# Altium schematic sheet 3_PowerDistribution.SchDoc: FPGA Power Distribution
size A3; Date: 12/24/2025; Author: Praveen Perera; DrawnBy: Praveen Perera; Engineer: Praveen Perera; Revision: 1; SheetNumber: 3; SheetTotal: 9
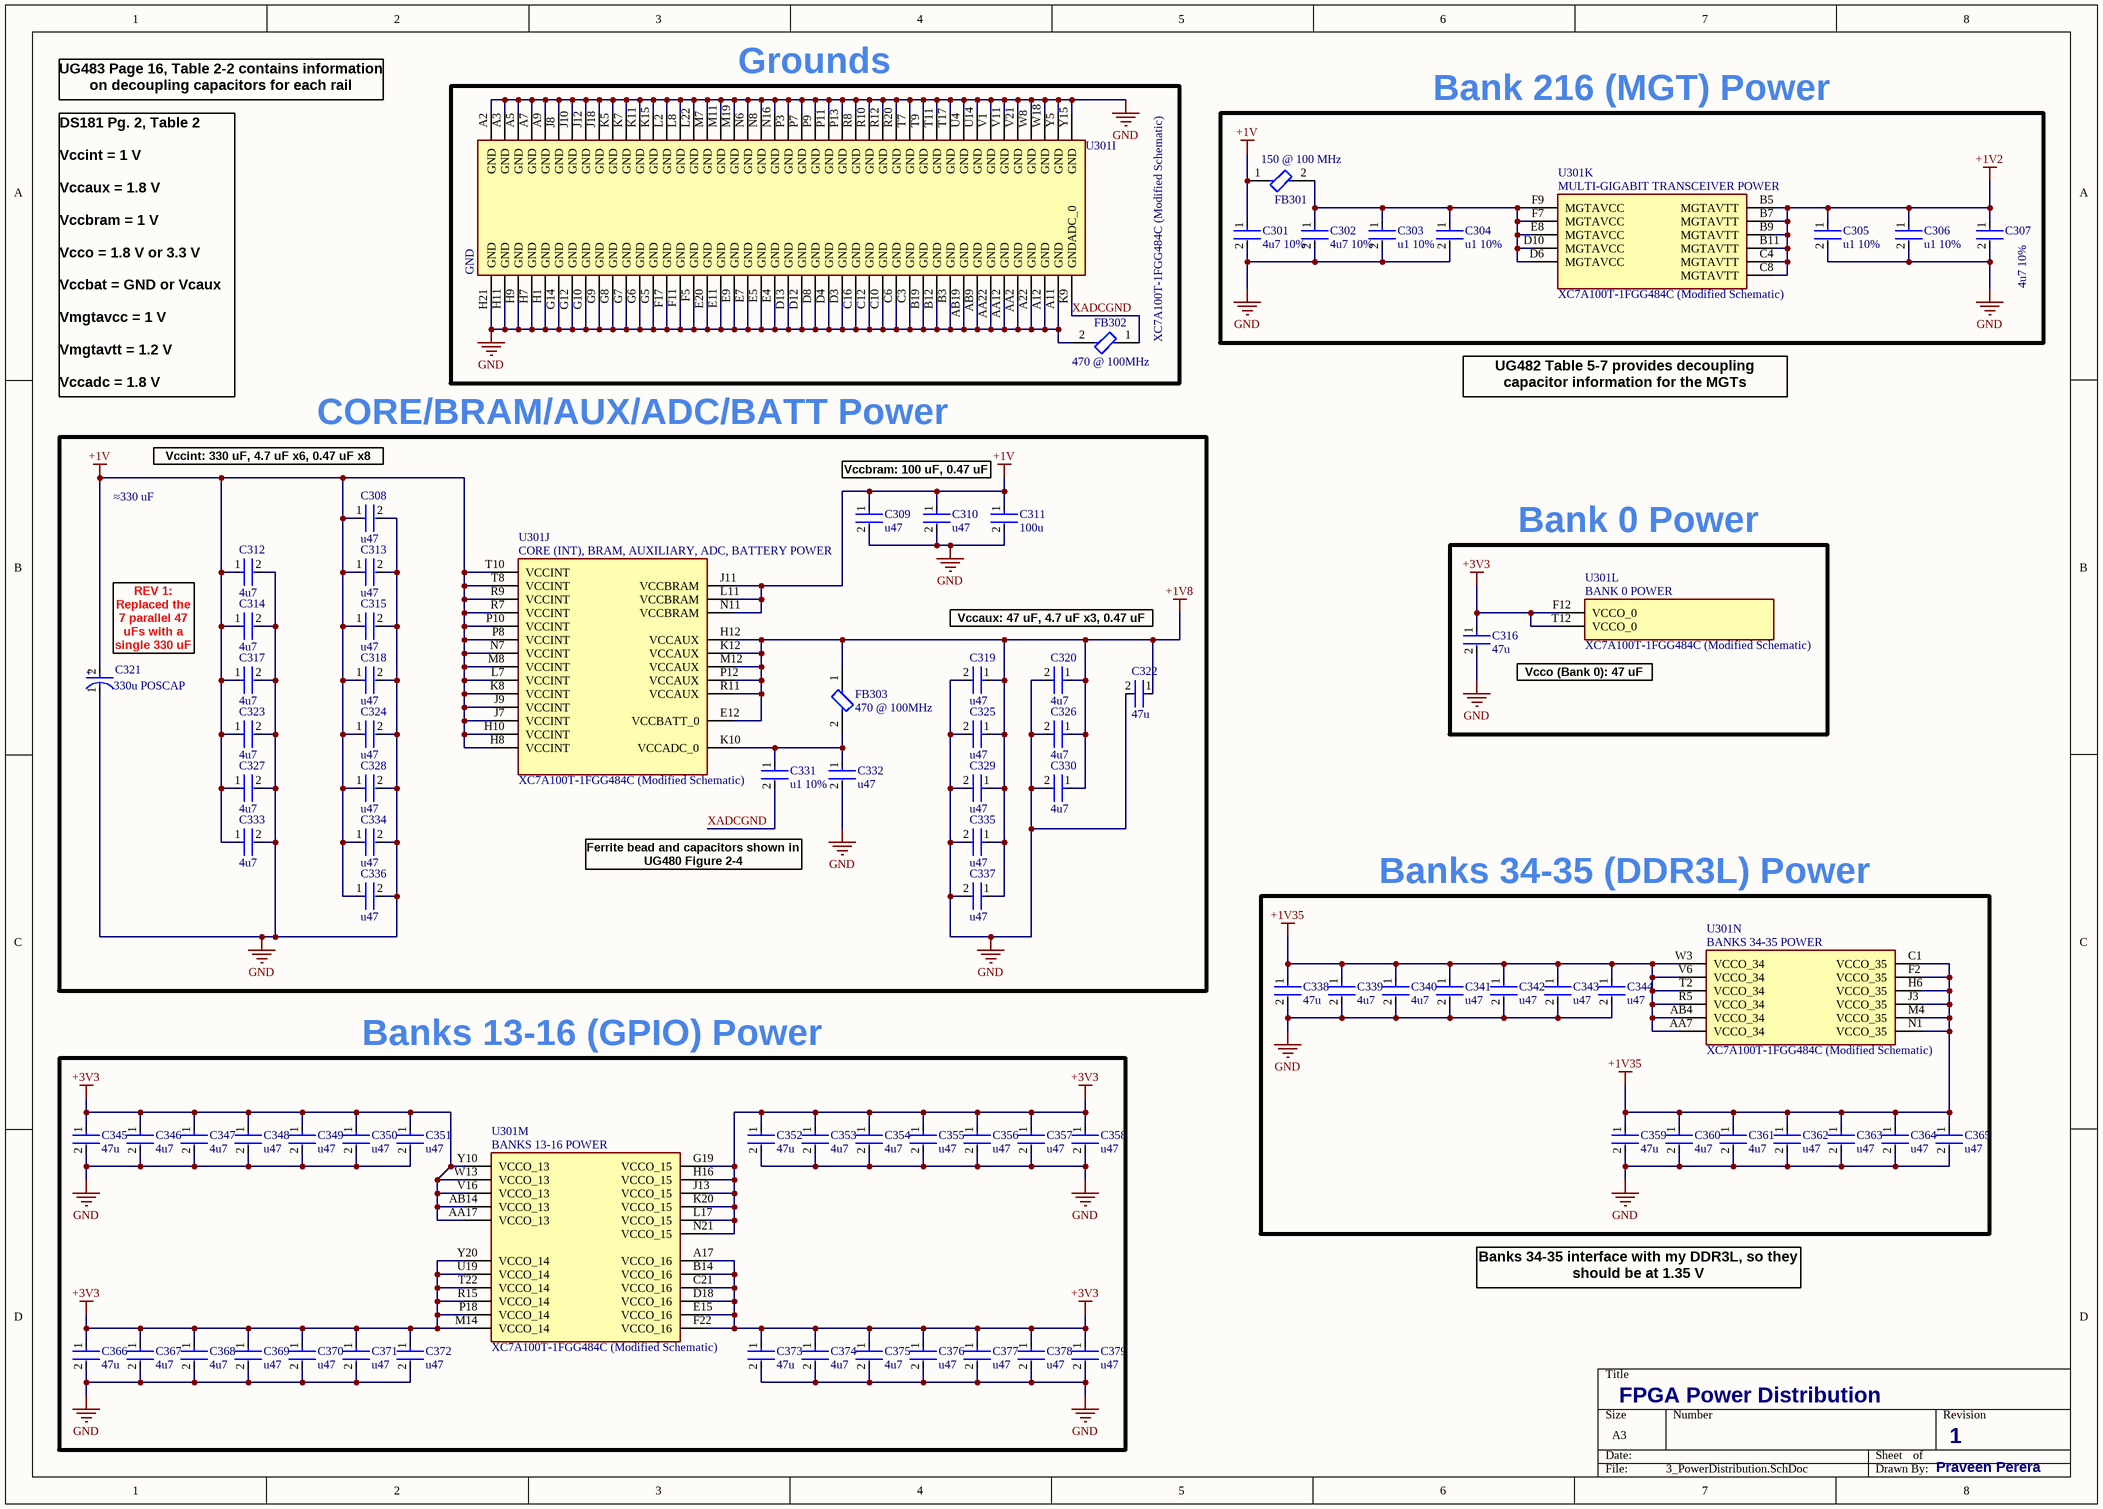
[diagram p0: 3_PowerDistribution.SchDoc]

## Parts
C301  4u7 10%  [FP-C1005-050-0_20-0_10-MFG]
C302  4u7 10%  [FP-C1005-050-0_20-0_10-MFG]
C303  u1 10%  [FP-CL891-IPC_C]
C304  u1 10%  [FP-CL891-IPC_C]
C305  u1 10%  [FP-CL891-IPC_C]
C306  u1 10%  [FP-CL891-IPC_C]
C307  4u7 10%  [FP-C1005-050-0_20-0_10-MFG]
C308  u47  [FP-C0603-030-0_03-IPC_A]
C309  u47  [FP-C0603-030-0_03-IPC_A]
C310  u47  [FP-C0603-030-0_03-IPC_A]
C311  100u  [FP-GRM21B-0_2-e0_2_0_7-IPC_A]
C312  4u7  [FP-CL829-IPC_C]
C313  u47  [FP-C0603-030-0_03-IPC_A]
C314  4u7  [FP-CL829-IPC_C]
C315  u47  [FP-C0603-030-0_03-IPC_A]
C316  47u  [FP-GRM188-0_2-IPC_B]
C317  4u7  [FP-CL829-IPC_C]
C318  u47  [FP-C0603-030-0_03-IPC_A]
C319  u47  [FP-C0603-030-0_03-IPC_A]
C320  4u7  [FP-CL829-IPC_C]
C321  330u POSCAP  [FP-POSCAP-D4-MFG]
C322  47u  [FP-GRM188-0_2-IPC_B]
C323  4u7  [FP-CL829-IPC_C]
C324  u47  [FP-C0603-030-0_03-IPC_A]
C325  u47  [FP-C0603-030-0_03-IPC_A]
C326  4u7  [FP-CL829-IPC_C]
C327  4u7  [FP-CL829-IPC_C]
C328  u47  [FP-C0603-030-0_03-IPC_A]
C329  u47  [FP-C0603-030-0_03-IPC_A]
C330  4u7  [FP-CL829-IPC_C]
C331  u1 10%  [FP-CL891-IPC_C]
C332  u47  [FP-C0603-030-0_03-IPC_A]
C333  4u7  [FP-CL829-IPC_C]
C334  u47  [FP-C0603-030-0_03-IPC_A]
C335  u47  [FP-C0603-030-0_03-IPC_A]
C336  u47  [FP-C0603-030-0_03-IPC_A]
C337  u47  [FP-C0603-030-0_03-IPC_A]
C338  47u  [FP-GRM188-0_2-IPC_B]
C339  4u7  [FP-CL829-IPC_C]
C340  4u7  [FP-CL829-IPC_C]
C341  u47  [FP-C0603-030-0_03-IPC_A]
C342  u47  [FP-C0603-030-0_03-IPC_A]
C343  u47  [FP-C0603-030-0_03-IPC_A]
C344  u47  [FP-C0603-030-0_03-IPC_A]
C345  47u  [FP-GRM188-0_2-IPC_B]
C346  4u7  [FP-CL829-IPC_C]
C347  4u7  [FP-CL829-IPC_C]
C348  u47  [FP-C0603-030-0_03-IPC_A]
C349  u47  [FP-C0603-030-0_03-IPC_A]
C350  u47  [FP-C0603-030-0_03-IPC_A]
C351  u47  [FP-C0603-030-0_03-IPC_A]
C352  47u  [FP-GRM188-0_2-IPC_B]
C353  4u7  [FP-CL829-IPC_C]
C354  4u7  [FP-CL829-IPC_C]
C355  u47  [FP-C0603-030-0_03-IPC_A]
C356  u47  [FP-C0603-030-0_03-IPC_A]
C357  u47  [FP-C0603-030-0_03-IPC_A]
C358  u47  [FP-C0603-030-0_03-IPC_A]
C359  47u  [FP-GRM188-0_2-IPC_B]
C360  4u7  [FP-CL829-IPC_C]
C361  4u7  [FP-CL829-IPC_C]
C362  u47  [FP-C0603-030-0_03-IPC_A]
C363  u47  [FP-C0603-030-0_03-IPC_A]
C364  u47  [FP-C0603-030-0_03-IPC_A]
C365  u47  [FP-C0603-030-0_03-IPC_A]
C366  47u  [FP-GRM188-0_2-IPC_B]
C367  4u7  [FP-CL829-IPC_C]
C368  4u7  [FP-CL829-IPC_C]
C369  u47  [FP-C0603-030-0_03-IPC_A]
C370  u47  [FP-C0603-030-0_03-IPC_A]
C371  u47  [FP-C0603-030-0_03-IPC_A]
C372  u47  [FP-C0603-030-0_03-IPC_A]
C373  47u  [FP-GRM188-0_2-IPC_B]
C374  4u7  [FP-CL829-IPC_C]
C375  4u7  [FP-CL829-IPC_C]
C376  u47  [FP-C0603-030-0_03-IPC_A]
C377  u47  [FP-C0603-030-0_03-IPC_A]
C378  u47  [FP-C0603-030-0_03-IPC_A]
C379  u47  [FP-C0603-030-0_03-IPC_A]
FB301  150 @ 100 MHz  [FP-MPZ1005-IPC_B]
FB302  470 @ 100MHz  [FP-BLM41-0_2-a1_2-IPC_B]
FB303  470 @ 100MHz  [FP-BLM41-0_2-a1_2-IPC_B]
U301  XC7A100T-1FGG484C (Modified Schematic)  [BGA484C100P22X22_2300X2300X260N]  (parts I,J,K,L,M,N of 14)

## Blocks framed on the sheet
≈330 uF: C308-C315 C317-C337 FB303 U301

## Nets
+1V: C301.1 C308.1 C309.1 C310.1 C311.1 C312.1 C313.1 C314.1 C315.1 C317.1 C318.1 C321.2(A) C323.1 C324.1 C327.1 C328.1 C333.1 C334.1 C336.1 FB301.1 U301.H8(VCCINT) U301.H10(VCCINT) U301.J7(VCCINT) U301.J9(VCCINT) U301.J11(VCCBRAM) U301.K8(VCCINT) U301.L7(VCCINT) U301.L11(VCCBRAM) U301.M8(VCCINT) U301.N7(VCCINT) U301.N11(VCCBRAM) U301.P8(VCCINT) U301.P10(VCCINT) U301.R7(VCCINT) U301.R9(VCCINT) U301.T8(VCCINT) U301.T10(VCCINT)
+1V2: C305.1 C306.1 C307.1 U301.B5(MGTAVTT) U301.B7(MGTAVTT) U301.B9(MGTAVTT) U301.B11(MGTAVTT) U301.C4(MGTAVTT) U301.C8(MGTAVTT)
+1V8: C319.1 C320.1 C322.1 C325.1 C326.1 C329.1 C330.1 C335.1 C337.1 FB303.1 U301.E12(VCCBATT_0) U301.H12(VCCAUX) U301.K12(VCCAUX) U301.M12(VCCAUX) U301.P12(VCCAUX) U301.R11(VCCAUX)
+1V35: C338.1 C339.1 C340.1 C341.1 C342.1 C343.1 C344.1 C359.1 C360.1 C361.1 C362.1 C363.1 C364.1 C365.1 U301.AA7(VCCO_34) U301.AB4(VCCO_34) U301.C1(VCCO_35) U301.F2(VCCO_35) U301.H6(VCCO_35) U301.J3(VCCO_35) U301.M4(VCCO_35) U301.N1(VCCO_35) U301.R5(VCCO_34) U301.T2(VCCO_34) U301.V6(VCCO_34) U301.W3(VCCO_34)
+3V3: C316.1 C345.1 C346.1 C347.1 C348.1 C349.1 C350.1 C351.1 C352.1 C353.1 C354.1 C355.1 C356.1 C357.1 C358.1 C366.1 C367.1 C368.1 C369.1 C370.1 C371.1 C372.1 C373.1 C374.1 C375.1 C376.1 C377.1 C378.1 C379.1 U301.A17(VCCO_16) U301.AA17(VCCO_13) U301.AB14(VCCO_13) U301.B14(VCCO_16) U301.C21(VCCO_16) U301.D18(VCCO_16) U301.E15(VCCO_16) U301.F12(VCCO_0) U301.F22(VCCO_16) U301.G19(VCCO_15) U301.H16(VCCO_15) U301.J13(VCCO_15) U301.K20(VCCO_15) U301.L17(VCCO_15) U301.M14(VCCO_14) U301.N21(VCCO_15) U301.P18(VCCO_14) U301.R15(VCCO_14) U301.T12(VCCO_0) U301.T22(VCCO_14) U301.U19(VCCO_14) U301.V16(VCCO_13) U301.W13(VCCO_13) U301.Y10(VCCO_13) U301.Y20(VCCO_14)
GND: C301.2 C302.2 C303.2 C304.2 C305.2 C306.2 C307.2 C308.2 C309.2 C310.2 C311.2 C312.2 C313.2 C314.2 C315.2 C316.2 C317.2 C318.2 C319.2 C320.2 C321.1(C) C322.2 C323.2 C324.2 C325.2 C326.2 C327.2 C328.2 C329.2 C330.2 C332.2 C333.2 C334.2 C335.2 C336.2 C337.2 C338.2 C339.2 C340.2 C341.2 C342.2 C343.2 C344.2 C345.2 C346.2 C347.2 C348.2 C349.2 C350.2 C351.2 C352.2 C353.2 C354.2 C355.2 C356.2 C357.2 C358.2 C359.2 C360.2 C361.2 C362.2 C363.2 C364.2 C365.2 C366.2 C367.2 C368.2 C369.2 C370.2 C371.2 C372.2 C373.2 C374.2 C375.2 C376.2 C377.2 C378.2 C379.2 FB302.2 U301.A2(GND) U301.A3(GND) U301.A5(GND) U301.A7(GND) U301.A9(GND) U301.A11(GND) U301.A12(GND) U301.A22(GND) U301.AA2(GND) U301.AA12(GND) U301.AA22(GND) U301.AB9(GND) U301.AB19(GND) U301.B3(GND) U301.B12(GND) U301.B19(GND) U301.C3(GND) U301.C6(GND) U301.C10(GND) U301.C12(GND) U301.C16(GND) U301.D3(GND) U301.D4(GND) U301.D8(GND) U301.D12(GND) U301.D13(GND) U301.E4(GND) U301.E5(GND) U301.E7(GND) U301.E9(GND) U301.E11(GND) U301.E20(GND) U301.F5(GND) U301.F11(GND) U301.F17(GND) U301.G5(GND) U301.G6(GND) U301.G7(GND) U301.G8(GND) U301.G9(GND) U301.G10(GND) U301.G12(GND) U301.G14(GND) U301.H1(GND) U301.H7(GND) U301.H9(GND) U301.H11(GND) U301.H21(GND) U301.J8(GND) U301.J10(GND) U301.J12(GND) U301.J18(GND) U301.K5(GND) U301.K7(GND) U301.K11(GND) U301.K15(GND) U301.L2(GND) U301.L8(GND) U301.L22(GND) U301.M7(GND) U301.M11(GND) U301.M19(GND) U301.N6(GND) U301.N8(GND) U301.N16(GND) U301.P3(GND) U301.P7(GND) U301.P9(GND) U301.P11(GND) U301.P13(GND) U301.R8(GND) U301.R10(GND) U301.R12(GND) U301.R20(GND) U301.T7(GND) U301.T9(GND) U301.T11(GND) U301.T17(GND) U301.U4(GND) U301.U14(GND) U301.V1(GND) U301.V11(GND) U301.V21(GND) U301.W8(GND) U301.W18(GND) U301.Y5(GND) U301.Y15(GND)
XADCGND: C331.2 FB302.1 U301.K9(GNDADC_0)
NetC302_1: C302.1 C303.1 C304.1 FB301.2 U301.D6(MGTAVCC) U301.D10(MGTAVCC) U301.E8(MGTAVCC) U301.F7(MGTAVCC) U301.F9(MGTAVCC)
NetC331_1: C331.1 C332.1 FB303.2 U301.K10(VCCADC_0)

## Notes on the sheet
- UG483 Page 16, Table 2-2 contains information on decoupling capacitors for each rail
- Grounds
- Bank 216 (MGT) Power
- DS181 Pg. 2, Table 2
  Vccint = 1 V
  Vccaux = 1.8 V
  Vccbram = 1 V
  Vcco = 1.8 V or 3.3 V
  Vccbat = GND or Vcaux
  Vmgtavcc = 1 V
  Vmgtavtt = 1.2 V
  Vccadc = 1.8 V
- (near FB302) CORE/BRAM/AUX/ADC/BATT Power
- UG482 Table 5-7 provides decoupling capacitor information for the MGTs
- Vccint: 330 uF, 4.7 uF x6, 0.47 uF x8
- Vccbram: 100 uF, 0.47 uF x2
- Bank 0 Power
- (near C321) REV 1: Replaced the 7 parallel 47 uFs with a single 330 uF
- Vccaux: 47 uF, 4.7 uF x3, 0.47 uF x5
- Vcco (Bank 0): 47 uF
- Ferrite bead and capacitors shown in UG480 Figure 2-4
- Banks 34-35 (DDR3L) Power
- Banks 13-16 (GPIO) Power
- Banks 34-35 interface with my DDR3L, so they should be at 1.35 V
- (in symbol CMP-05428-001073-1) +
- (in symbol XC7A100T-1FGG484C, part J) CORE (INT), BRAM, AUXILIARY, ADC, BATTERY POWER
- (in symbol XC7A100T-1FGG484C, part K) MULTI-GIGABIT TRANSCEIVER POWER
- (in symbol XC7A100T-1FGG484C, part L) BANK 0 POWER
- (in symbol XC7A100T-1FGG484C, part M) BANKS 13-16 POWER
- (in symbol XC7A100T-1FGG484C, part N) BANKS 34-35 POWER

## Library data of the parts
C301 C302 C307 = CMP-08246-007228-1: C1005X5R1A475K050BE / CAP CER 4.7UF 10V X5R 0402; Max Operating Temperature: 85°C; Case Code (Metric): 1005; Voltage Rating: 10V; Tolerance: 10%; Packaging: Tape and Reel; Capacitance: 4.7uF; Case/Package: 0402; Features: Soft Termination; Min Operating Temperature: -55°C; Mount: Surface Mount; Case Code (Imperial): 0402; RoHS Compliant: Yes
C303-C306 C331 = CMP-13271-001945-1: CL05B104KB5NNNC / Cap Ceramic 100nF 50V X7R ±10% SMD 0402 +125°C Paper T/R
C308-C310 C313 C315 C318 C319 C324 C325 C328 C329 C332 C334-C337 C341-C344 C348-C351 C355-C358 C362-C365 C369-C372 C376-C379 = CMP-08246-006895-1: C0603X5R1A474M030BC / Multilayer Ceramic Capacitors 470nF ±20% 10V X5R SMD 0201; Package Quantity: 1; Mount: Surface Mount; RoHS Compliant: Yes; Case/Package: 0201; Case Code (Metric): 0603; Max Operating Temperature: 85°C; Series: C; Min Operating Temperature: -55°C; Length: 0.024inch; Dielectric Material: Ceramic; REACH SVHC: No SVHC; Lead Free: Lead Free; Case Code (Imperial): 0201; Width: 0.012inch; Dielectric: X5R; Capacitance: 470nF; Tolerance: 20%; Thickness: 0.013inch; Voltage Rating: 10V; Packaging: Cut Tape; Voltage Rating (DC): 10V
C311 = CMP-2000-07599-2: GRM21BR60J107ME15L / Chip Multilayer Ceramic Capacitors for General Purpose, 0805, 100uF, X5R, 15%, 20%, 6.3V; Length: 0.079inch; Dielectric: X5R; Case Code (Metric): 2012; Max Operating Temperature: 85°C; Voltage Rating (DC): 6.3V; Min Operating Temperature: -55°C; Tolerance: 20%; Packaging: Cut Tape; Voltage Rating: 6.3V; Capacitance: 100uF; REACH SVHC: No SVHC; Width: 0.049inch; Mount: Surface Mount; Case/Package: 0805; Case Code (Imperial): 0805; Lead Free: Lead Free; Thickness: 0.057inch
C312 C314 C317 C320 C323 C326 C327 C330 C333 C339 C340 C346 C347 C353 C354 C360 C361 C367 C368 C374 C375 = CMP-13271-001468-1: CL05A475MO5NUNC / Cap Ceramic 4.7uF 16V X5R ±20% SMD 0402 +85°C Paper T/R; Mount: Surface Mount; Case Code (Metric): 1005; Case/Package: 0402; Length: 0.039inch; Capacitance: 4.7uF; Voltage Rating: 16V; Max Operating Temperature: 85°C; Tolerance: 20%; Thickness: 0.022inch; Min Operating Temperature: -55°C; Case Code (Imperial): 0402; Packaging: Tape and Reel; Width: 0.02inch
C316 C322 C338 C345 C352 C359 C366 C373 = CMP-2000-05444-2: GRM188R60J476ME15D / Chip Multilayer Ceramic Capacitors for General Purpose, 0603, 47uF, X5R, 15%, 20%, 6.3V; Voltage Rating (DC): 6.3V; Thickness: 0.039inch; Case Code (Imperial): 0603; Packaging: Tape and Reel; Capacitance: 47uF; Width: 0.031inch; Dielectric: X5R; Max Operating Temperature: 85°C; Mount: Surface Mount; Case Code (Metric): 1608; Length: 0.063inch; Voltage Rating: 6.3V; Tolerance: 20%; Case/Package: 0603; Min Operating Temperature: -55°C
C321 = CMP-05428-001073-1: 10TCE330M / CAP TANT POLY 330UF 10V 2917; Tolerance: 20%; ESR (Equivalent Series Resistance): 25mR; Life (Hours): 1000Hour; Packaging: Cut Tape; Case Code (Metric): 7343; Min Operating Temperature: -55°C; Capacitance: 330uF; Max Operating Temperature: 125°C; Case Code (Imperial): 2917; RoHS Compliant: Yes; Series: POSCAP® TC; Width: 0.169inch; Height - Seated (Max): 0.157inch; Case/Package: 2917; Mount: Surface Mount; Features: General Purpose; Voltage Rating (DC): 10V; Length: 0.287inch; Voltage Rating: 10V
FB301 = CMP-08257-000209-1: MPZ1005A151ETD25 / Power line Ferrite Bead 150Ω @ 100MHz 0.8A DCR 0.18Ω AEC-Q200 SMD 0402; RoHS Compliant: Yes
FB302 FB303 = CMP-0686-00760-3: BLM41PG471SN1L / Ferrite Bead, 1806, 470Ω @ 100MHz, 25%, 0.05Ω, 2A; Material: Steel; Number of Circuits: 1; Shielding: Unshielded; DC Resistance (DCR): 50mR; Impedance: 470R; Min Operating Temperature: -55°C; Case/Package: 1806; Packaging: Tape and Reel; DC Current: 2A; Frequency: 100MHz; Length: 4.5mm; Max Operating Temperature: 125°C; Package Quantity: 1; Max Current Rating: 2A; Radiation Hardening: No; RoHS Compliant: Yes; Lead Free: Lead Free; Height: 1.6mm; Test Frequency: 100MHz; Series: BLM41P; Width: 1.6mm; Core Material: Ferrite; Case Code (Imperial): 1806; Termination: SMD/SMT; Tolerance: 25%; Number of Pins: 2; Number of Lines: 1; Case Code (Metric): 4516; Current Rating: 2A; Max DC Current: 2A; DC Resistance-Max: 50mR; Depth: 1.6mm; Military Standard: Not
U301 = XC7A100T-1FGG484C: Artix-7 Field Programmable Gate Array (FPGA) IC 285 4976640 101440 484-BBGA; MF: Xilinx Inc.; Check_prices: https://www.snapeda.com/parts/XC7A100T-1FGG484C/Xilinx/view-part/?ref=eda; MP: XC7A100T-1FGG484C; Package: FBGA-484 Xilinx; SnapEDA_Link: https://www.snapeda.com/parts/XC7A100T-1FGG484C/Xilinx/view-part/?ref=snap; Value: *